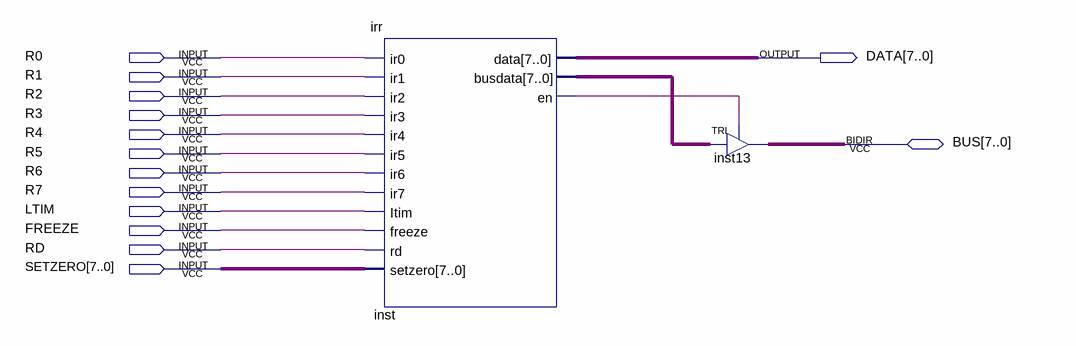
[diagram p0: schematic sheet]
// Quartus schematic irr_a.bdf as structural Verilog: 2 symbols, 14 pins
module irr_a (
  input  R0,
  input  R1,
  input  R2,
  input  R3,
  input  R4,
  input  R5,
  input  R6,
  input  R7,
  input  LTIM,
  input  FREEZE,
  input  RD,
  input  [7:0] SETZERO,
  inout  [7:0] BUS,
  output [7:0] DATA
);

  wire inst_en;
  wire [7:0] inst_busdata;

  irr inst (
    .ir0(R0), .ir1(R1), .ir2(R2), .ir3(R3), .ir4(R4), .ir5(R5), .ir6(R6), .ir7(R7), .Itim(LTIM),
    .freeze(FREEZE), .rd(RD), .setzero(SETZERO), .data(DATA), .busdata(inst_busdata), .en(inst_en));
  TRI inst13[7:0] (.IN(inst_busdata), .OE(inst_en), .OUT(BUS));
endmodule
